# Altium schematic sheet 0157_V5A and V3P3A GENE.SchDoc
size A3
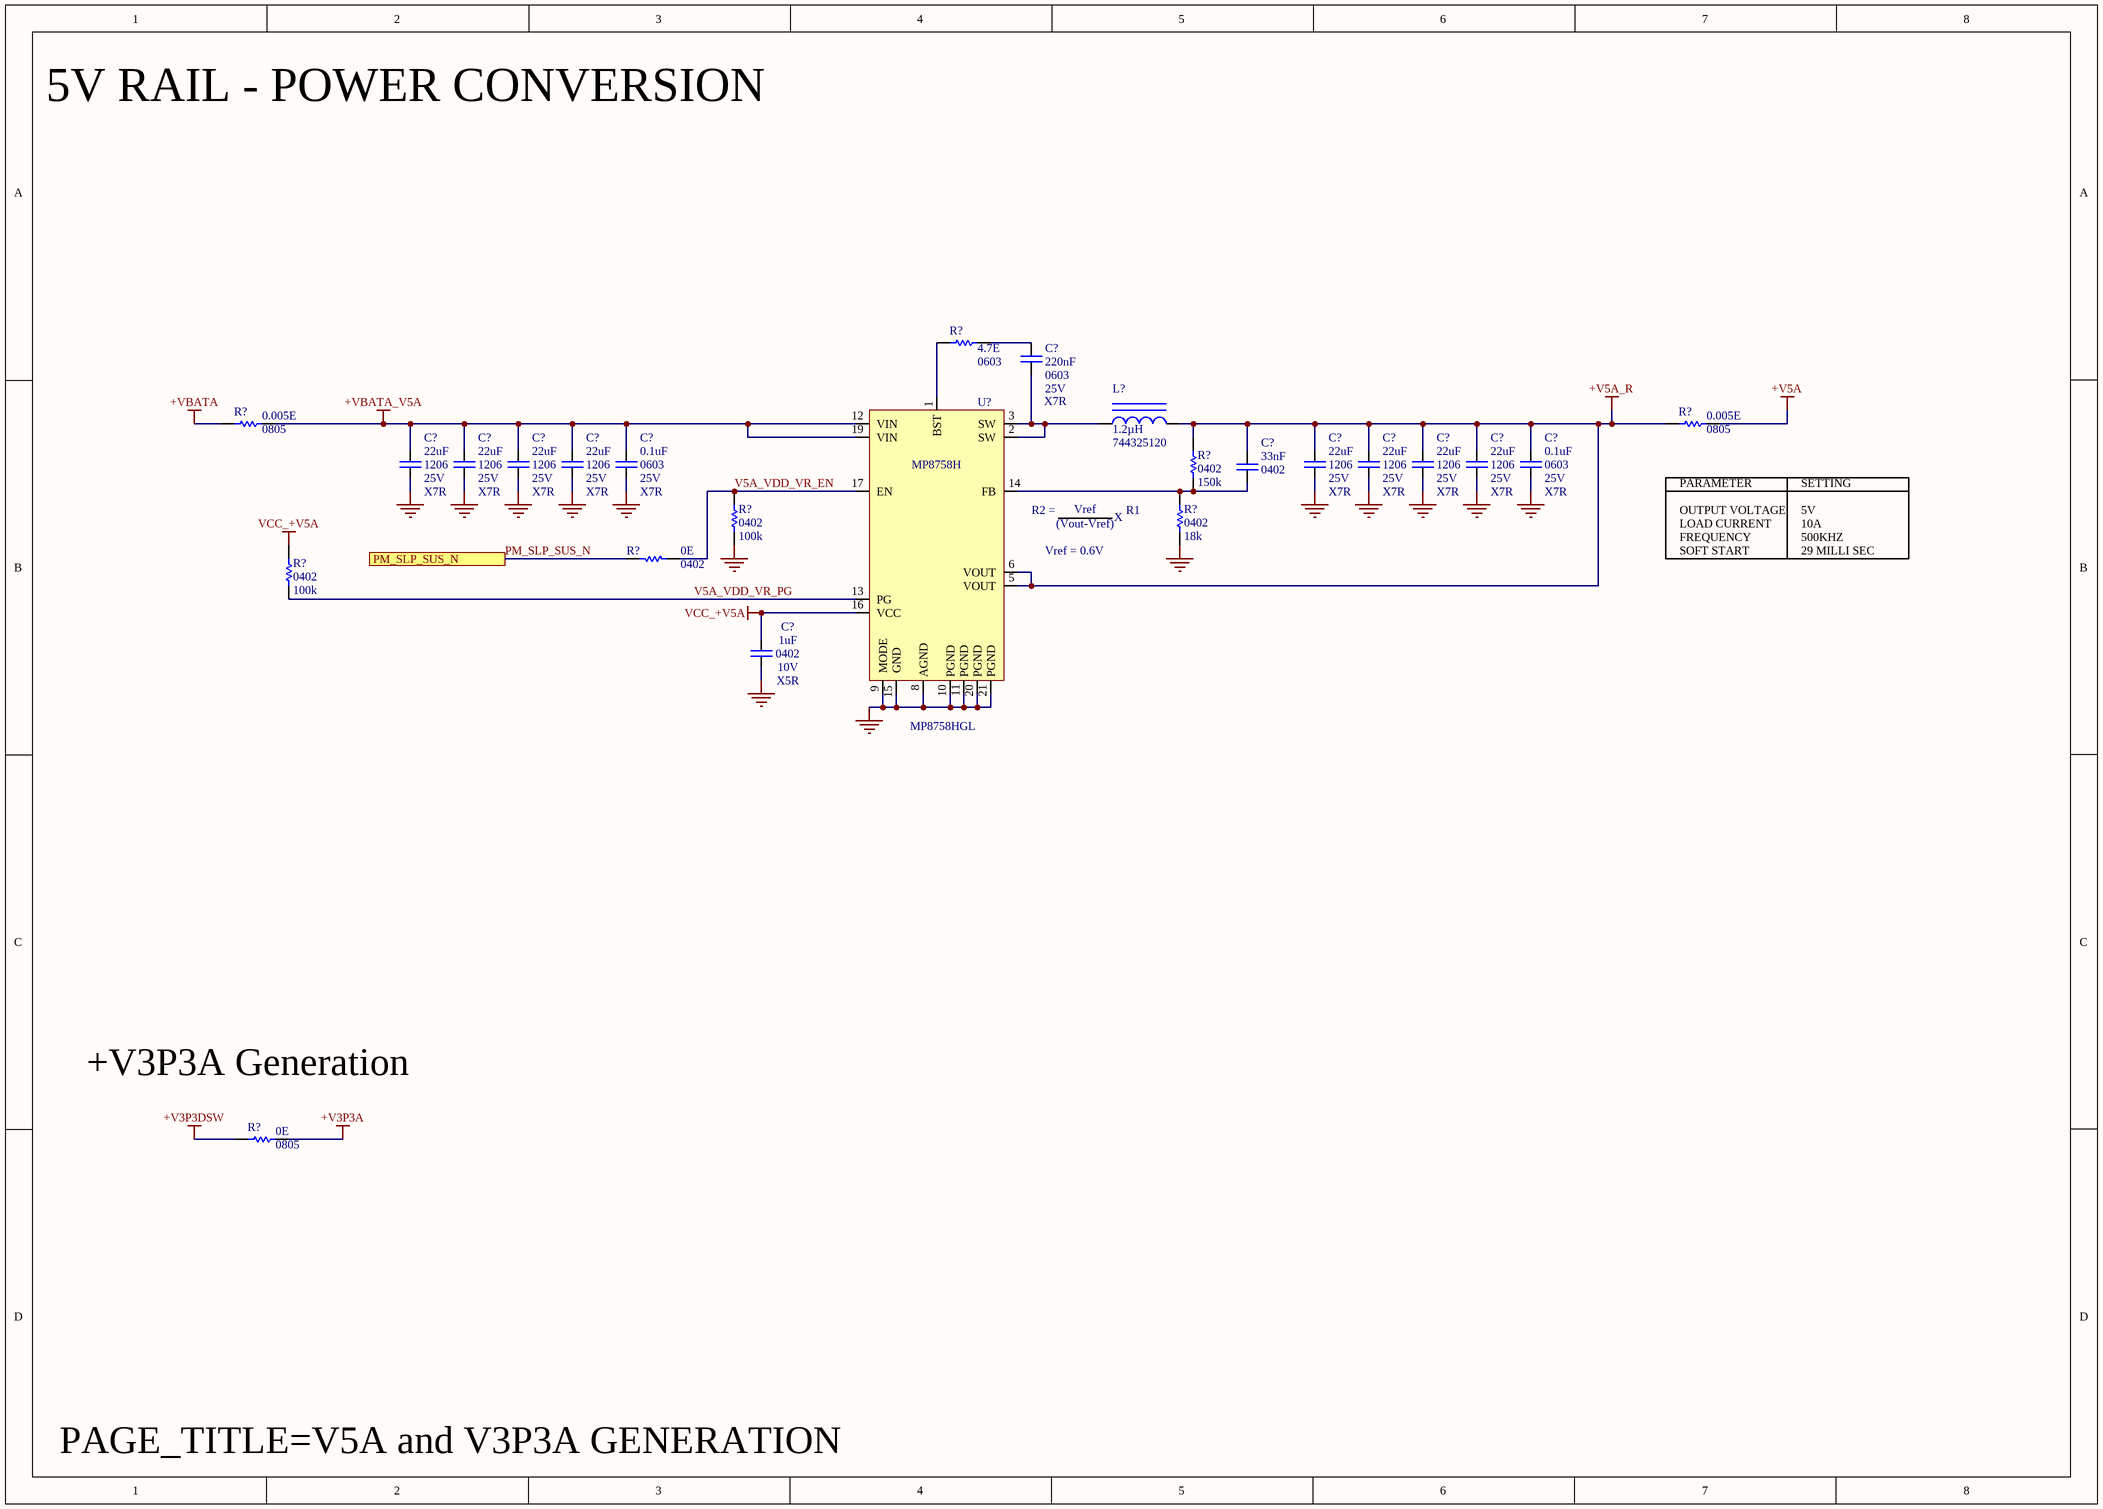
[diagram p0: 0157_V5A and V3P3A GENE.SchDoc]

## Parts
(Parts that share a designator on the sheet are numbered #1, #2 ... from top to bottom, then left to right.)
C?#1  value 220nF  Case/Package: 0603  Dielectric: X7R  Voltage: 25V  [CAPC0603]  (hidden comment: Cap)
C?#2  value 22uF  Case/Package: 1206  Voltage: 25V  Dielectric: X7R  [CAPC1206]
C?#3  value 22uF  Case/Package: 1206  Voltage: 25V  Dielectric: X7R  [CAPC1206]
C?#4  value 22uF  Case/Package: 1206  Voltage: 25V  Dielectric: X7R  [CAPC1206]
C?#5  value 22uF  Case/Package: 1206  Voltage: 25V  Dielectric: X7R  [CAPC1206]
C?#6  value 0.1uF  Case/Package: 0603  Voltage: 25V  Dielectric: X7R  [CAPC0603]
C?#7  value 22uF  Case/Package: 1206  Voltage: 25V  Dielectric: X7R  [CAPC1206]
C?#8  value 22uF  Case/Package: 1206  Voltage: 25V  Dielectric: X7R  [CAPC1206]
C?#9  value 22uF  Case/Package: 1206  Voltage: 25V  Dielectric: X7R  [CAPC1206]
C?#10  value 22uF  Case/Package: 1206  Voltage: 25V  Dielectric: X7R  [CAPC1206]
C?#11  value 0.1uF  Case/Package: 0603  Voltage: 25V  Dielectric: X7R  [CAPC0603]
C?#12  value 33nF  Case/Package: 0402  [CAPC0402]  (hidden comment: Cap)
C?#13  value 1uF  Case/Package: 0402  Voltage: 10V  Dielectric: X5R  [CAPC0402]
L?  value 1.2µH  Manufacturer Part Number: 744325120  [IND-716530]  (hidden comment: C351096)
R?#1  value 4.7E  Case/Package: 0603  [RESC0603]  (hidden comment: Res)
R?#2  value 0.005E  Case/Package: 0805  [RESC0805]  (hidden comment: Res)
R?#3  value 0.005E  Case/Package: 0805  [RESC0805]  (hidden comment: Res)
R?#4  value 150k  Case/Package: 0402  [RESC0402]  (hidden comment: Res)
R?#5  value 100k  Case/Package: 0402  [RESC0402]  (hidden comment: Res)
R?#6  value 18k  Case/Package: 0402  [RESC0402]  (hidden comment: Res)
R?#7  value 0E  Case/Package: 0402  [RESC0402]  (hidden comment: Res)
R?#8  value 100k  Case/Package: 0402  [RESC0402]  (hidden comment: Res)
R?#9  value 0E  Case/Package: 0805  [RESC0805]  (hidden comment: Res)
U?  Manufacturer Part Number: MP8758HGL  [MP8758H_QFN-21 (3mmx4mm)]  (hidden comment: MP8758H)

## Ports
PM_SLP_SUS_N

## Nets
+V3P3A: R?#9.2
+V3P3DSW: R?#9.1
+V5A: R?#3.2
+V5A_R: C?#7.2 C?#8.2 C?#9.2 C?#10.2 C?#11.2 C?#12.2 L?.2 R?#3.1 R?#4.1 U?.5(VOUT) U?.6(VOUT)
+VBATA: R?#2.1
+VBATA_V5A: C?#2.2 C?#3.2 C?#4.2 C?#5.2 C?#6.2 R?#2.2 U?.12(VIN) U?.19(VIN)
GND: C?#2.1 C?#3.1 C?#4.1 C?#5.1 C?#6.1 C?#7.1 C?#8.1 C?#9.1 C?#10.1 C?#11.1 C?#13.1 R?#5.2 R?#6.2 U?.8(AGND) U?.9(MODE) U?.10(PGND) U?.11(PGND) U?.15(GND) U?.20(PGND) U?.21(PGND)
VCC_+V5A: C?#13.2 R?#8.1 U?.16(VCC)
PM_SLP_SUS_N: R?#7.2 ; port PM_SLP_SUS_N
V5A_VDD_VR_EN: R?#5.1 R?#7.1 U?.17(EN)
V5A_VDD_VR_PG: R?#8.2 U?.13(PG)
NetC?#1_1: C?#1.1 L?.1 U?.2(SW) U?.3(SW)
NetC?#1_2: C?#1.2 R?#1.2
NetC?#12_1: C?#12.1 R?#4.2 R?#6.1 U?.14(FB)
NetR?#1_1: R?#1.1 U?.1(BST)

## Notes on the sheet
- 5V RAIL - POWER CONVERSION
- (near U?) R2 =
- Vref
- X
- (near R?#6) R1
- PARAMETER
- OUTPUT VOLTAGE
- SETTING
- 5V
- (near U?) Vref = 0.6V
- (Vout-Vref)
- FREQUENCY
- SOFT START
- LOAD CURRENT
- 500KHZ
- 10A
- 29 MILLI SEC
- +V3P3A Generation
- PAGE_TITLE=V5A and V3P3A GENERATION

## Library data of the parts
C?#1 = Cap: CAP CER 220nF 25V X7R 0603; Manufacturer Part Number: GRM188R71E224KA88D
C?#2-C?#5 C?#7-C?#10 = Cap: CAP CER 22uF 25V X7R 1206; Manufacturer Part Number: CL31A226KAHNNNE
C?#6 C?#11 = Cap: CAP CER 0.1uF 25V X7R 0603; Manufacturer Part Number: CL10B104KA8NNND
C?#12 = Cap: CAP CER 33nF 25V X7R 0402; Manufacturer Part Number: C0402C333K3REC; Dielectric: X7R; Voltage: 25V
C?#13 = Cap: CAP CER 1uF 10V X5R 0402
L? = Inductor: Power Inductors 1.2uH, 20A,1.8mΩ,111005; Case/Package: IND-11mm×10.2mm
R?#1 = Res: Thick Film Resistor -  4.7ohm, 1%, 0603; Manufacturer Part Number: RL0603FR-074R7L
R?#2 R?#3 = Res: Thick Film Resistor -  0.005ohm, 1%, 0805
R?#4 = Res: Thick Film Resistor -  150Kohm, 1%, 0402
R?#5 R?#8 = Res: Thick Film Resistor -  100Kohm, 1%, 0402
R?#6 = Res: Thick Film Resistor -  18Kohm, 0.1%, 0402
R?#7 = Res: Thick Film Resistor -  0ohm, 1%, 0402
R?#9 = Res: Thick Film Resistor -  0ohm, 1%, 0805
U? = MP8758H: IC REG BUCK ADJUSTABLE 10A 21QFN; Case/Package: QFN-21